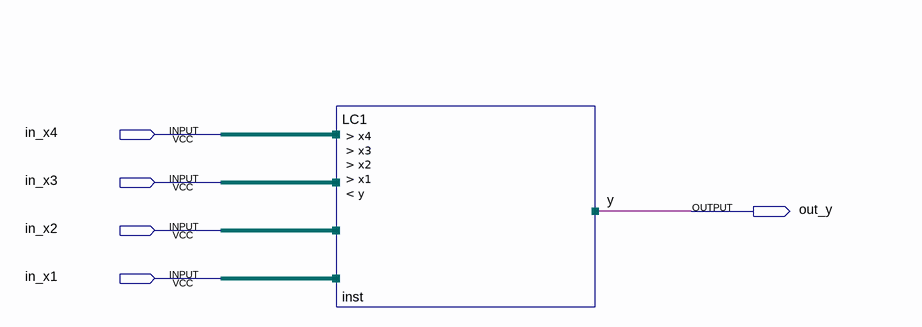
[diagram p0: schematic sheet]
// Quartus schematic CL_Dominskyi_v1.bdf as structural Verilog: 1 symbols, 5 pins
module CL_Dominskyi_v1 (
  input  in_x4,
  input  in_x3,
  input  in_x2,
  input  in_x1,
  output out_y
);

  LC1 inst (.x4(in_x4), .x3(in_x3), .x2(in_x2), .x1(in_x1), .y(out_y));

  // Other names for the same wires on the sheet: y = out_y
endmodule
